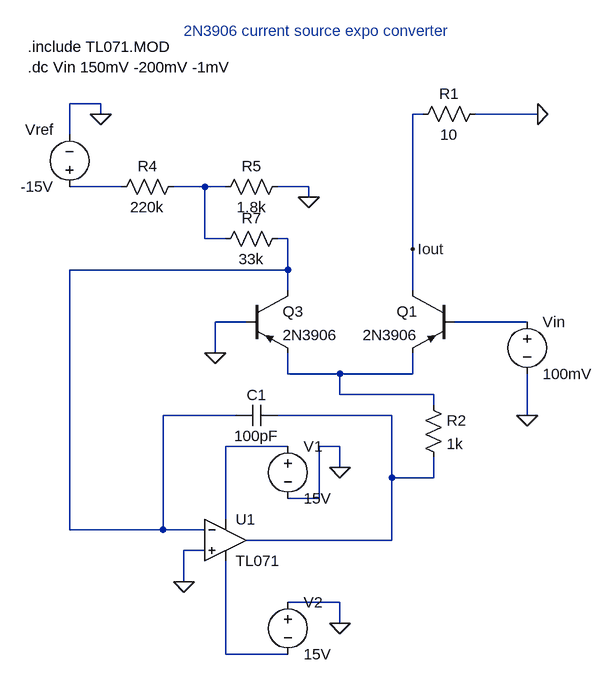
[diagram p0: schematic juno106BetaFilterReplacement_ExpoPart.asc]
juno106BetaFilterReplacement_ExpoPart.asc, the LTspice schematic file:
Version 4
SHEET 1 880 680
WIRE -304 -208 -352 -208
WIRE -304 -192 -304 -208
WIRE 192 -192 176 -192
WIRE 368 -192 272 -192
WIRE -352 -160 -352 -208
WIRE -272 -80 -352 -80
WIRE -144 -80 -192 -80
WIRE -112 -80 -144 -80
WIRE 16 -80 -32 -80
WIRE 16 -64 16 -80
WIRE -144 0 -144 -80
WIRE -112 0 -144 0
WIRE -16 0 -32 0
WIRE 176 16 176 -192
WIRE -16 48 -16 0
WIRE -16 48 -352 48
WIRE -16 80 -16 48
WIRE 176 80 176 16
WIRE -80 128 -128 128
WIRE 352 128 240 128
WIRE -128 176 -128 128
WIRE -16 208 -16 176
WIRE 64 208 -16 208
WIRE 176 208 176 176
WIRE 176 208 64 208
WIRE 64 240 64 208
WIRE 208 240 64 240
WIRE 208 256 208 240
WIRE -96 272 -208 272
WIRE 144 272 -32 272
WIRE 352 272 352 208
WIRE -16 320 -112 320
WIRE 64 320 32 320
WIRE 64 352 64 320
WIRE 144 368 144 272
WIRE 208 368 208 336
WIRE 208 368 144 368
WIRE 32 400 32 320
WIRE 32 400 -16 400
WIRE -112 432 -112 320
WIRE -352 448 -352 48
WIRE -208 448 -208 272
WIRE -208 448 -352 448
WIRE -144 448 -208 448
WIRE 144 464 144 368
WIRE 144 464 -80 464
WIRE -144 480 -176 480
WIRE -176 528 -176 480
WIRE 64 560 -16 560
WIRE 64 592 64 560
WIRE -112 640 -112 496
WIRE -16 640 -112 640
FLAG -304 -192 0
FLAG 352 272 0
FLAG 64 352 0
FLAG 64 592 0
FLAG -176 528 0
FLAG 176 16 Iout
FLAG 368 -192 0
FLAG -128 176 0
FLAG 16 -64 0
SYMBOL voltage -352 -64 R180
WINDOW 0 24 104 Left 0
WINDOW 3 24 16 Left 0
WINDOW 123 0 0 Left 0
WINDOW 39 0 0 Left 0
SYMATTR InstName Vref
SYMATTR Value -15V
SYMBOL voltage 352 112 R0
WINDOW 123 0 0 Left 0
WINDOW 39 0 0 Left 0
SYMATTR InstName Vin
SYMATTR Value 100mV
SYMBOL Opamps\\opamp2 -112 400 R0
SYMATTR InstName U1
SYMATTR Value TL071
SYMBOL voltage -16 304 R0
WINDOW 123 0 0 Left 0
WINDOW 39 0 0 Left 0
SYMATTR InstName V1
SYMATTR Value 15V
SYMBOL voltage -16 544 R0
WINDOW 123 0 0 Left 0
WINDOW 39 0 0 Left 0
SYMATTR InstName V2
SYMATTR Value 15V
SYMBOL cap -32 256 R90
WINDOW 0 0 32 VBottom 0
WINDOW 3 32 32 VTop 0
SYMATTR InstName C1
SYMATTR Value 100pF
SYMBOL pnp -80 80 R0
SYMATTR InstName Q3
SYMATTR Value 2N3906
SYMBOL pnp 240 80 M0
SYMATTR InstName Q1
SYMATTR Value 2N3906
SYMBOL res 288 -208 R90
WINDOW 0 0 56 VBottom 0
WINDOW 3 32 56 VTop 0
SYMATTR InstName R1
SYMATTR Value 10
SYMBOL res 192 240 R0
SYMATTR InstName R2
SYMATTR Value 1k
SYMBOL res -176 -96 R90
WINDOW 0 0 56 VBottom 0
WINDOW 3 32 56 VTop 0
SYMATTR InstName R4
SYMATTR Value 220k
SYMBOL res -16 -96 R90
WINDOW 0 0 56 VBottom 0
WINDOW 3 32 56 VTop 0
SYMATTR InstName R5
SYMATTR Value 1.8k
SYMBOL res -16 -16 R90
WINDOW 0 0 56 VBottom 0
WINDOW 3 32 56 VTop 0
SYMATTR InstName R7
SYMATTR Value 33k
TEXT -416 -296 Left 0 !.include TL071.MOD
TEXT -416 -264 Left 0 !.dc Vin 150mV -200mV -1mV
TEXT -176 -320 Left 0 ;2N3906 current source expo converter

The netlist it stands for:
* juno106BetaFilterReplacement_ExpoPart.asc
Vref N001 0 -15V
Vin N004 0 100mV
XU1 0 N003 N007 N008 N006 TL071  ; pins In+ In- V+ V- OUT
V1 N007 0 15V
V2 0 N008 15V
C1 N006 N003 100pF
Q3 N003 0 N005 0 2N3906
Q1 Iout N004 N005 0 2N3906
R1 0 Iout 10
R2 N005 N006 1k
R4 N002 N001 220k
R5 0 N002 1.8k
R7 N003 N002 33k
.model NPN NPN
.model PNP PNP
.lib standard.bjt
.include TL071.MOD
.dc Vin 150mV -200mV -1mV
* 2N3906 current source expo converter
.backanno
.end